# Altium project TSAL_Inverters.PrjPcb
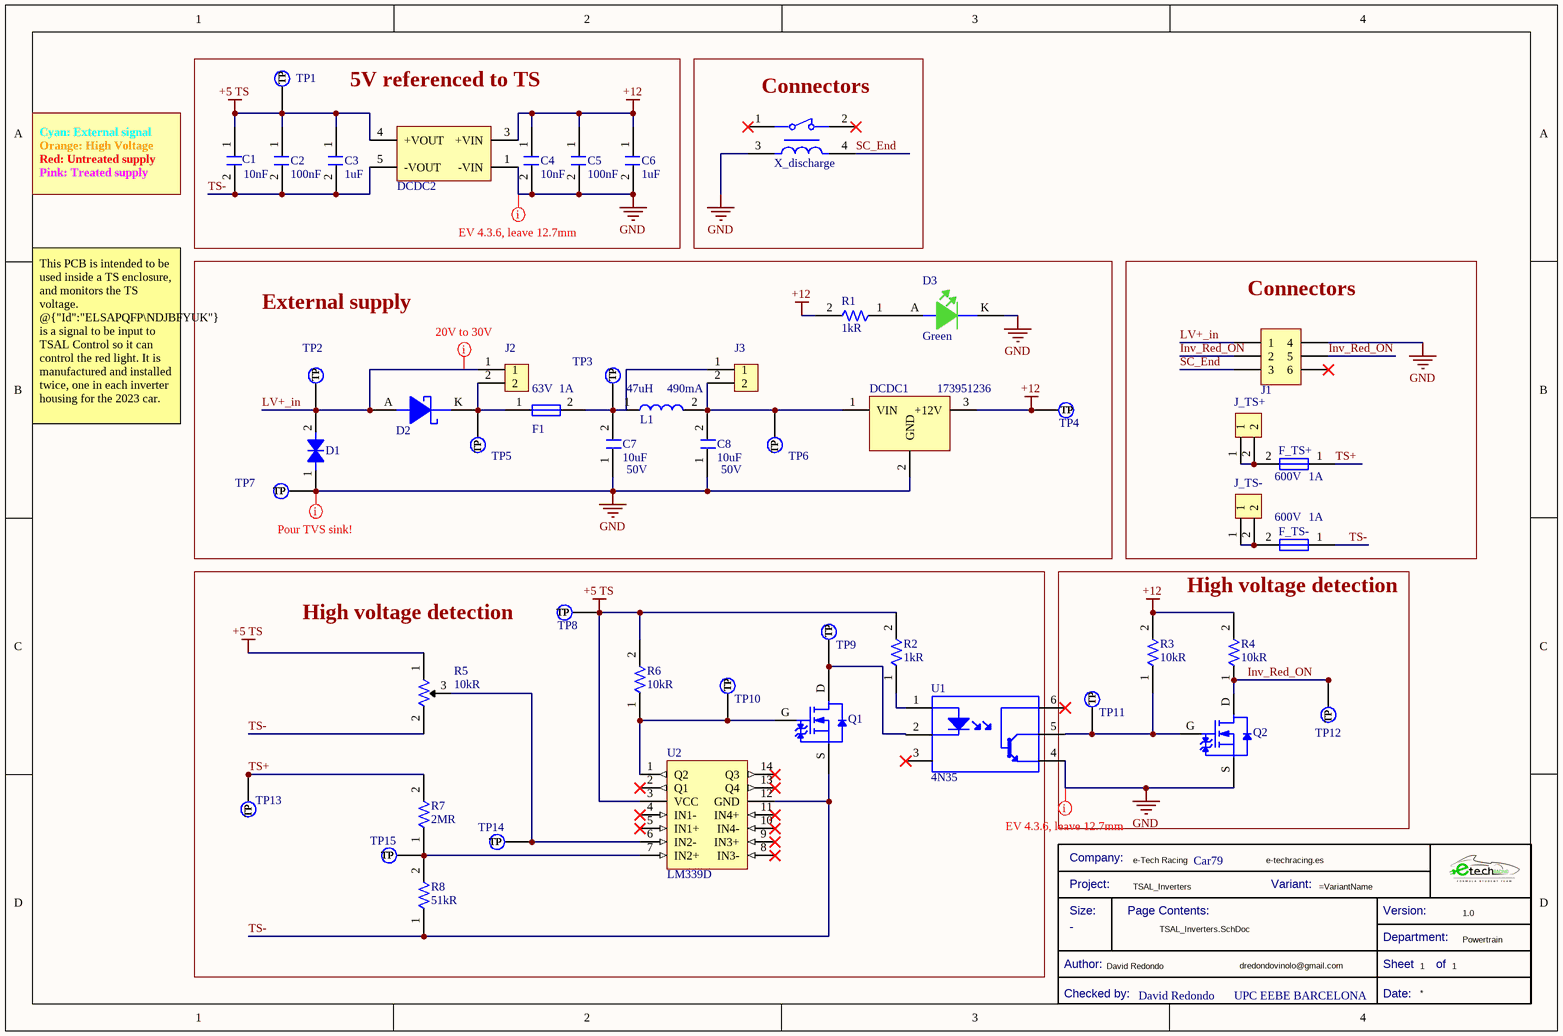
[diagram p0: TSAL_Inverters.SchDoc]
Company: e-Tech Racing; Department: Powertrain; DesignedByURL: e-techracing.es; DesignerMail: dredondovinolo@gmail.com; DesignerName: David Redondo; Project: TSAL_Inverters; ReviewerName: David Redondo; Version: 1.0
1 sheet, 51 parts. Net scope: global (net labels, ports and power ports of the same name join across sheets).
Board file: TSAL_Inverters.PcbDoc

## Sheet TSAL_Inverters.SchDoc
size A4; SheetNumber: 1; SheetTotal: 1

### Parts
*  Checked by:: David Redondo  (hidden comment: Title Block_template)  (graphical)
C1  Capacitance: 10nF  [C0805FNPC-R]  (hidden comment: 885012207092)
C2  Capacitance: 100nF  [C0805FNPC-R]  (hidden comment: 885012207098)
C3  Capacitance: 1uF  [C0805FNPC-R]  (hidden comment: 885012207103)
C4  Capacitance: 10nF  [C0805FNPC-R]  (hidden comment: 885012207092)
C5  Capacitance: 100nF  [C0805FNPC-R]  (hidden comment: 885012207098)
C6  Capacitance: 1uF  [C0805FNPC-R]  (hidden comment: 885012207103)
C7  Voltage Rating: 50V  Capacitance: 10uF  [C10u-50V-1210FNPMLCC-X7R]  (hidden comment: GRJ32ER71H106KE11L)
C8  Voltage Rating: 50V  Capacitance: 10uF  [C10u-50V-1210FNPMLCC-X7R]  (hidden comment: GRJ32ER71H106KE11L)
D1  824551301  [DTVS-DO-214AB]  (value not drawn)
D2  MBR0530  [DSC-SOD123]  (value not drawn)
D3  Color: Green  [LED_0805_WE]  (hidden comment: 150080VS75000)
DCDC1  173951236  [DCDC_Magi3c]
DCDC2  RNM-1205S/P  [DCDC_RNM-XX05S/P]  (value not drawn)
F1  Current Rating: 1A  Voltage Rating (DC): 63V  [Fuse_1206]  (hidden comment: 0437001.WRA)
F_TS+  Voltage Rating (DC): 600V  Current Rating: 1A  [Fuse_485001]  (hidden comment: 485001)
F_TS-  Voltage Rating (DC): 600V  Current Rating: 1A  [Fuse_485001]  (hidden comment: 485001)
J1  J_NanoFit_2x3  [J_NanoFit_2x3]  (value not drawn)
J2  61300211121  [J_Pinheader_1x2]  (value not drawn)
J3  61300211121  [J_Pinheader_1x2]  (value not drawn)
J_TS+  436500215  [J_MicroFit_2x1]  (value not drawn)
J_TS-  436500215  [J_MicroFit_2x1]  (value not drawn)
L1  Current Rating: 490mA  Inductance: 47uH  [L_47u-490mA_CF]  (hidden comment: CDC5D23BNP-470KC)
Q1  SQ2318BES-T1_GE3  [TRT-NCH-3/35-CPH]  (value not drawn)
Q2  SQ2318BES-T1_GE3  [TRT-NCH-3/35-CPH]  (value not drawn)
R1  Resistance: 1kR  [R0805FTK]  (hidden comment: CR0805-JW-102ELF)
R2  Resistance: 1kR  [R0805FTK]  (hidden comment: CR0805-JW-102ELF)
R3  Resistance: 10kR  [R0805FTK]  (hidden comment: CR0805-JW-103ELF)
R4  Resistance: 10kR  [R0805FTK]  (hidden comment: CR0805-JW-103ELF)
R5  Resistance: 10kR  [R10k-VTR]  (hidden comment: 3296W-1-103LF)
R6  Resistance: 10kR  [R0805FTK]  (hidden comment: CR0805-JW-103ELF)
R7  Resistance: 2MR  [R2512FTK]  (hidden comment: R2M-2512FTK)
R8  Resistance: 51kR  [R1206FTK-W]  (hidden comment: CRCW120610K0FKEA)
TP1  TestPoint  [TestPoint]  (value not drawn)  (no BOM)
TP2  TestPoint  [TestPoint]  (value not drawn)  (no BOM)
TP3  TestPoint  [TestPoint]  (value not drawn)  (no BOM)
TP4  TestPoint  [TestPoint]  (value not drawn)  (no BOM)
TP5  TestPoint  [TestPoint]  (value not drawn)  (no BOM)
TP6  TestPoint  [TestPoint]  (value not drawn)  (no BOM)
TP7  TestPoint  [TestPoint]  (value not drawn)  (no BOM)
TP8  TestPoint  [TestPoint]  (value not drawn)  (no BOM)
TP9  TestPoint  [TestPoint]  (value not drawn)  (no BOM)
TP10  TestPoint  [TestPoint]  (value not drawn)  (no BOM)
TP11  TestPoint  [TestPoint]  (value not drawn)  (no BOM)
TP12  TestPoint  [TestPoint]  (value not drawn)  (no BOM)
TP13  TestPoint  [TestPoint]  (value not drawn)  (no BOM)
TP14  TestPoint  [TestPoint]  (value not drawn)  (no BOM)
TP15  TestPoint  [TestPoint]  (value not drawn)  (no BOM)
U1  4N35  [Optocoupler_4N35]
U2  LM339D  [Array_4_Amp_LM339D]
X_discharge  DBR72410FU  [Relay_DAR72410FU]  (value not drawn)

### Blocks framed on the sheet
5V referenced to TS: C1-C6 DCDC2 TP1
Connectors: X_discharge
External supply: C7 C8 D1-D3 DCDC1 F1 J2 J3 L1 R1 TP2-TP7
Connectors: F_TS+ F_TS- J1 J_TS+ J_TS-
High voltage detection: Q1 R2 R5-R8 TP8-TP10 TP13-TP15 U1 U2
High voltage detection: Q2 R3 R4 TP11 TP12

### Nets
+5 TS: C1.1 C2.1 C3.1 DCDC2.4(+VOUT) R2.2 R5.1 R6.2 TP1.1(TP) TP8.1(TP) U2.3(VCC)
+12: C4.1 C5.1 C6.1 DCDC1.3(+12V) DCDC2.3(+VIN) R1.2 R3.2 R4.2 TP4.1(TP)
GND: C4.2 C5.2 C6.2 C7.1 C8.1 D1.1 D3.K DCDC1.2(GND) DCDC2.1(-VIN) J1.4 Q2.S TP7.1(TP) U1.4(E) X_discharge.3
Inv_Red_ON: J1.2 J1.5 Q2.D R4.1 TP12.1(TP)
LV+_in: D1.2 D2.A J1.1 J2.1 TP2.1(TP)
SC_End: J1.3 X_discharge.4
TS+: F_TS+.1 R7.2 TP13.1(TP)
TS-: C1.2 C2.2 C3.2 DCDC2.5(-VOUT) F_TS-.1 Q1.S R5.2 R8.1 U2.12(GND)
NetC7_2: C7.2 F1.2 J3.1 L1.1 TP3.1(TP)
NetC8_2: C8.2 DCDC1.1(VIN) J3.2 L1.2 TP6.1(TP)
NetD2_K: D2.K F1.1 J2.2 TP5.1(TP)
NetD3_A: D3.A R1.1
NetF_TS+_2: F_TS+.2 J_TS+.1 J_TS+.2
NetF_TS-_2: F_TS-.2 J_TS-.1 J_TS-.2
NetQ1_D: Q1.D TP9.1(TP) U1.2(K)
NetQ1_G: Q1.G R6.1 TP10.1(TP) U2.1(Q2)
NetQ2_G: Q2.G R3.1 TP11.1(TP) U1.5(E)
NetR2_1: R2.1 U1.1(A)
NetR5_3: R5.3 TP14.1(TP) U2.6(IN2-)
NetR7_1: R7.1 R8.2 TP15.1(TP) U2.7(IN2+)

Not connected (* = marked no-connect by the designer): J1 6*; U1 3(C)* 6(E)*; U2 2(Q1)* 4(IN1-)* 5(IN1+)* 8(IN3-)* 9(IN3+)* 10(IN4-)* 11(IN4+)* 13(Q4)* 14(Q3)*; X_discharge 1* 2*

### Layout directives
mark named EV 4.3.6, leave 12.7mm: GND
mark named Pour TVS sink!: GND
mark named 20V to 30V: LV+_in

### Notes on the sheet
- Cyan: External signal
- Orange: High Voltage
- Red: Untreated supply
- Pink: Treated supply
- This PCB is intended to be used inside a TS enclosure, and monitors the TS voltage. @{"Id":"ELSAPQFP\NDJBFYUK"} is a signal to be input to TSAL Control so it can control the red light. It is manufactured and installed twice, one in each inverter housing for the 2023 car.
- Car79
- UPC EEBE BARCELONA
- (in symbol Title Block_template) Company:; Project:; Variant:; Size:; Page Contents:; Version:; Department:; Author:; Sheet; of; Checked by:; Date:

### Library data of the parts
* = Title Block_template: Standard Title Block; .Creator: GP; Category: Title Block; .PCBcheck: GP; .SCHcheck: GP; Size: -
C1 C4 = C10n-50V-0805FNPC-X7R: Cap, 0.01ΜF, 50V, 10%, X7R, 0805; Manufacturer 1: Wurth Electronics; .Creator: DR; Supplier 1: RSComponents; Manufacturer Part Number 1: 885012207092; RoHS: Yes; Category: Ceramic Capacitors; Stock 1: 1; Pricing 1: 4000=0,03200, 12000=0,03100 (USD); Mount: Surface Mount; Case/Package: 0805; Case Code (Metric): 2012; Case Code (Imperial): 0805; Min Operating Temperature: -55°C; Max Operating Temperature: 125°C; Packaging: Cut Tape; Voltage Rating: 50V; Dielectric: X7R; Tolerance: 10%; Voltage Rating (DC): 50V; Length: 0.079inch; Width: 0.049inch; Thickness: 0.035inch; REACH SVHC: Unknown; RoHS Compliant: Yes; ComponentLink1URL: http://www.farnell.com/datasheets/1958497.pdf?src-supplier=Farnell; ComponentLink1Description: http://www.farnell.com/datasheets/1958497.pdf?src-supplier=Farnell; ComponentLink2URL: http://www.farnell.com/datasheets/1958497.pdf?src-supplier=Element14; ComponentLink2Description: http://www.farnell.com/datasheets/1958497.pdf?src-supplier=Element14; ComponentLink3URL: http://www.farnell.com/datasheets/1958497.pdf?src-supplier=Newark; ComponentLink3Description: http://www.farnell.com/datasheets/1958497.pdf?src-supplier=Newark; ComponentLink4URL: https://katalog.we-online.de/pbs/datasheet/885012207092.pdf?src-supplier=Digi-Key; ComponentLink4Description: https://katalog.we-online.de/pbs/datasheet/885012207092.pdf?src-supplier=Digi-Key; Supplier Part Number 1: 1813941
C2 C5 = C100n-50V-0805FNPC-X7R: Cap, 0.1ΜF, 50V, 10%, X7R, 0805; Manufacturer 1: Wurth Electronics; .Creator: DR; Supplier 1: RSComponents; Manufacturer Part Number 1: 885012207098; RoHS: Yes; Category: Ceramic Capacitors; Stock 1: 8000; Pricing 1: 100=0,10200, 500=0,07100, 2000=0,06100 (GBP); Mount: Surface Mount; Case/Package: 0805; Case Code (Metric): 2012; Case Code (Imperial): 0805; Min Operating Temperature: -55°C; Max Operating Temperature: 125°C; Packaging: Cut Tape; Voltage Rating: 50V; Dielectric: X7R; Tolerance: 10%; Voltage Rating (DC): 50V; Length: 0.079inch; Width: 0.049inch; Thickness: 0.035inch; REACH SVHC: Unknown; RoHS Compliant: Yes; ComponentLink1URL: http://www.farnell.com/datasheets/1958498.pdf?src-supplier=Farnell; ComponentLink1Description: http://www.farnell.com/datasheets/1958498.pdf?src-supplier=Farnell; ComponentLink2URL: http://www.farnell.com/datasheets/1958498.pdf?src-supplier=Element14; ComponentLink2Description: http://www.farnell.com/datasheets/1958498.pdf?src-supplier=Element14; ComponentLink3URL: https://katalog.we-online.de/pbs/datasheet/885012207098.pdf?src-supplier=Digi-Key; ComponentLink3Description: https://katalog.we-online.de/pbs/datasheet/885012207098.pdf?src-supplier=Digi-Key; ComponentLink4URL: http://www.farnell.com/datasheets/1958498.pdf?src-supplier=Newark; ComponentLink4Description: http://www.farnell.com/datasheets/1958498.pdf?src-supplier=Newark; Supplier Part Number 1: 1813493
C3 C6 = C1u-50V-0805FNPC-X7R: Multilayer Ceramic Capacitor, Wcap-Csgp Series, 1 F, 10%, X7R, 50 V, 0805 [2012 Metric] Rohs Compliant: Yes; Manufacturer 1: Wurth Electronics; Voltage Rating: 50V; .Creator: GP; Supplier 1: RSComponents; Manufacturer Part Number 1: 885012207103; RoHS: Yes; Category: Ceramic Capacitors; Stock 1: 5100; Pricing 1: 50=0,27200, 250=0,25300, 500=0,22800, 1250=0,20100, 2500=0,17100 (GBP); Mount: Surface Mount; Case/Package: 0805; Case Code (Metric): 2012; Case Code (Imperial): 0805; Min Operating Temperature: -55°C; Max Operating Temperature: 85°C; Packaging: Cut Tape; Dielectric: X7R; Tolerance: 10%; Voltage Rating (DC): 50V; Length: 0.079inch; Width: 0.049inch; Thickness: 0.053inch; REACH SVHC: Unknown; RoHS Compliant: Yes; ComponentLink1URL: http://www.farnell.com/datasheets/1958501.pdf?src-supplier=Farnell; ComponentLink1Description: http://www.farnell.com/datasheets/1958501.pdf?src-supplier=Farnell; ComponentLink2URL: http://www.farnell.com/datasheets/1958501.pdf?src-supplier=Element14; ComponentLink2Description: http://www.farnell.com/datasheets/1958501.pdf?src-supplier=Element14; ComponentLink3URL: https://katalog.we-online.de/pbs/datasheet/885012107003.pdf?src-supplier=Digi-Key; ComponentLink3Description: https://katalog.we-online.de/pbs/datasheet/885012107003.pdf?src-supplier=Digi-Key; ComponentLink4URL: http://www.farnell.com/datasheets/1958501.pdf?src-supplier=Newark; ComponentLink4Description: http://www.farnell.com/datasheets/1958501.pdf?src-supplier=Newark; Supplier Part Number 1: 1813523
C7 C8 = C10u-50V-1210FNPMLCC-X7R: Multilayer Ceramic Capacitors MLCC - SMD/SMT 1210 10uF 50volts X7R +/-10% Soft Term; Manufacturer: Murata; Tolerance: 10%; .Creator: DR; Supplier 1: Avnet; Manufacturer Part Number: GRJ32ER71H106KE11L; RoHS: Yes; Category: Ceramic Capacitors; Stock 1: 19000; Pricing 1: 1000=0,33327, 2000=0,32389, 4000=0,31450, 6000=0,30511, 8000=0,29572 (USD); Mount: Surface Mount; Case/Package: 1210; Case Code (Metric): 3225; Case Code (Imperial): 1210; Min Operating Temperature: -55°C; Max Operating Temperature: 125°C; Packaging: Tape and Reel; Features: Soft Termination; Length: 0.126inch; Width: 0.098inch; Thickness: 0.11inch; RoHS Compliant: Yes; ComponentLink1URL: https://eu.mouser.com/datasheet/2/281/GRJ32ER71H106KE11_01-1977929.pdf; ComponentLink1Description: Datasheet; Supplier Part Number 1: GRJ32ER71H106KE11L
D1 = DTVS-40V-DO-214AB: TVS diode [Würth Elektronik] 824551301 TVS diode; Manufacturer: Wurth Electronics; Number of Bidirectional Channels: 1; Reverse Standoff Voltage: 30V; Min Breakdown Voltage: 35.05V; Clamping Voltage: 48.4V; Peak Pulse Power: 3kW; Power Line Protection: No; Polarity: Bidirectional; Peak Pulse Current: 62A; .Creator: DO; ComponentLink2Description: Where buy it; ComponentLink2URL: https://www.we-online.com/catalog/en/WE-TVSP?sq=824551301#824551301; Supplier 1: RSComponents; Manufacturer Part Number: 824551301; RoHS: Yes; Category: TVS Diodes; Stock 1: 1; Pricing 1: 10=1,72500, 50=1,54700, 100=1,45300, 250=1,35100, 500=1,15000 (USD); Mount: Surface Mount; Number of Pins: 2; Min Operating Temperature: -65°C; Max Operating Temperature: 150°C; Packaging: Cut Tape; Max Breakdown Voltage: 35.05V; Resistor Type: Zener; REACH SVHC: Unknown; RoHS Compliant: Yes; ComponentLink1URL: http://www.farnell.com/datasheets/2036459.pdf?src-supplier=Element14; ComponentLink1Description: http://www.farnell.com/datasheets/2036459.pdf?src-supplier=Element14; Supplier Part Number 1: 9217092P
D2 = DSC-0.5/30-SOD123: VR=30V IF=500mA 30pF P=410mW; Element Configuration: Single; Forward Voltage: 430mV; Peak Non-Repetitive Surge Current: 5.5A; Average Rectified Current: 500mA; Max Reverse Leakage Current: 130uA; Max Reverse Voltage (DC): 30V; Polarity: Standard; .Creator: GP; Category: Diode; ComponentLink1Description: Datasheet; ComponentLink1URL: *; ComponentLink2Description: Where buy it; ComponentLink2URL: *; Supplier 1: Newark; Stock 1: 9; Pricing 1: 1=0,34400, 10=0,23900, 100=0,12200, 500=0,10000 (USD); Mount: Surface Mount; Contact Plating: Tin,Matte; Weight: 0.03g; Package Quantity: 1; Max Surge Current: 5.5A; Forward Current: 500mA; Max Reverse Current: 130uA; Max Repetitive Reverse Voltage (Vrrm): 30V; Max Forward Surge Current (Ifsm): 5.5A; Voltage Rating (DC): 30V; Current Rating: 500mA; Output Current: 500mA; Series: -; Length: 2.7mm; Width: 1.6mm; Height: 1.03mm; Radiation Hardening: No; RoHS Compliant: Yes; REACH SVHC: No SVHC; Lead Free: Lead Free; ComponentLink3URL: https://datasheet.ciiva.com/30479/0900766b810e2512-30479401.pdf?src-supplier=RSComponents; ComponentLink3Description: https://datasheet.ciiva.com/30479/0900766b810e2512-30479401.pdf?src-supplier=RSComponents; ComponentLink4URL: https://datasheet.ciiva.com/34301/974753-34301826.pdf?src-supplier=Jameco; ComponentLink4Description: https://datasheet.ciiva.com/34301/974753-34301826.pdf?src-supplier=Jameco; ComponentLink5URL: https://datasheet.ciiva.com/910/mbr0530-910516.pdf?src-supplier=Digi-Key; ComponentLink5Description: https://datasheet.ciiva.com/910/mbr0530-910516.pdf?src-supplier=Digi-Key; ComponentLink6URL: https://datasheet.ciiva.com/25931/mbr0530-25931989.pdf?src-supplier=Avnet+Europe; ComponentLink6Description: https://datasheet.ciiva.com/25931/mbr0530-25931989.pdf?src-supplier=Avnet+Europe; ComponentLink7URL: https://datasheet.ciiva.com/8300/mbr0530-8300905.pdf?src-supplier=Avnet; ComponentLink7Description: https://datasheet.ciiva.com/8300/mbr0530-8300905.pdf?src-supplier=Avnet; ComponentLink8URL: https://datasheet.ciiva.com/17318/mbr0530-17318568.pdf?src-supplier=Future+Electronics; ComponentLink8Description: https://datasheet.ciiva.com/17318/mbr0530-17318568.pdf?src-supplier=Future+Electronics; ComponentLink9URL: https://datasheet.ciiva.com/15144/getdatasheetpartid-86760-15144598.pdf?src-supplier=Verical; ComponentLink9Description: https://datasheet.ciiva.com/15144/getdatasheetpartid-86760-15144598.pdf?src-supplier=Verical; ComponentLink10URL: https://datasheet.ciiva.com/910/mbr0530-910518.pdf?src-supplier=Digi-Key; ComponentLink10Description: https://datasheet.ciiva.com/910/mbr0530-910518.pdf?src-supplier=Digi-Key; Supplier Part Number 1: 15R3453
D3 = LEDVS-0805-40: Led, Green, 570 Nm, 2 V, 30 Ma, 40 Mcd Rohs Compliant: Yes; Manufacturer 1: Wurth Electronics; Luminous Intensity: 40mcd; Forward Current: 30mA; Forward Voltage: 2V; Viewing Angle: 140°; Wavelength: 570nm; Lens Style: Clear,Rectangular; Test Current: 20mA; .Creator: DR; ComponentLink1Description: Datasheet; ComponentLink1URL: https://www.we-online.com/catalog/datasheet/150080VS75000.pdf; ComponentLink2Description: Where buy it; ComponentLink2URL: https://katalog.we-online.de/en/led/WL-SMCW/150080VS75000; Supplier 1: RSComponents; Manufacturer Part Number 1: 150080VS75000; RoHS: Yes; Category: LEDs; Stock 1: 850; Pricing 1: 50=0,19300, 500=0,12900, 1000=0,12300, 2000=0,11700, 4000=0,11100 (USD); Mount: Surface Mount; Case/Package: 0805; Case Code (Metric): 2012; Case Code (Imperial): 0805; Min Operating Temperature: -40°C; Max Operating Temperature: 85°C; Package Quantity: 4000; Packaging: Tape and Reel; Dominant Wavelength: 570nm; Length: 2mm; Width: 1.25mm; Height: 0.7mm; REACH SVHC: Unknown; ComponentLink3URL: https://datasheet.ciiva.com/22656/150080vs75000-22656966.pdf?src-supplier=Element14; ComponentLink3Description: https://datasheet.ciiva.com/22656/150080vs75000-22656966.pdf?src-supplier=Element14; ComponentLink4URL: https://datasheet.ciiva.com/29279/759437-da-01-en-chipled-0805-w-kl-h-gruen-150080vs7500-29279047.pdf?src-supplier=Conrad; ComponentLink4Description: https://datasheet.ciiva.com/29279/759437-da-01-en-chipled-0805-w-kl-h-gruen-150080vs7500-29279047.pdf?src-supplier=Conrad; ComponentLink5URL: https://datasheet.ciiva.com/29563/150080vs75000-29563018.pdf?src-supplier=Digi-Key; ComponentLink5Description: https://datasheet.ciiva.com/29563/150080vs75000-29563018.pdf?src-supplier=Digi-Key; Supplier Part Number 1: 8154237
DCDC1 = DCDC-36V/12V-0.5A: Fdsm Fixed Step Down Regulator M; Manufacturer 1: Wurth Electronics; Supplier 1: Digi-Key; Manufacturer Part Number 1: 173951236; RoHS: No; Category: Board Mount Modules; Stock 1: 32; Pricing 1: 1=3,29000, 10=2,99100, 20=2,81300, 30=2,63600, 43=2,39907 (USD); Supplier Part Number 1: 732-173951236-ND; ComponentLink1Description: Datasheet; ComponentLink1URL: https://www.we-online.com/catalog/datasheet/173951236.pdf
DCDC2 = DCDC_RNM-1205S/P: 1W DC/DC-Converter 'ECONOLINE' DIP6 1kV unreg; V. In: 12; V. Out: 05; mA. Out: 200; Manufacturer 1: Recom; Min Input Voltage: 10.8V; Number of Outputs: 1; Efficiency: 78%; Voltage - Output 1: 5V; Max Input Voltage: 13.2V; Max Output Current: 200mA; Nominal Input Voltage: 12V; Supplier 1: Mouser; Manufacturer Part Number 1: RNM-1205S/P; RoHS: Yes; Category: Voltage Regulators - Switching; Stock 1: 40; Pricing 1: 1=8,32000, 10=8,08000, 50=7,84000, 100=7,60000, 1000=6,65000, 10000=6,42000 (USD); Mount: Through Hole; Case/Package: DIP; Weight: 1.1g; Min Operating Temperature: -40°C; Max Operating Temperature: 85°C; Output Power: 1W; Packaging: Rail/Tube; Package Quantity: 60; Isolation Voltage: 1kV; Max Power Dissipation: 1W; Max Output Voltage: 5V; Features: SCP; Series: ECONOLINE RNM; Length: 8.3mm; Width: 8.3mm; Height: 6.8mm; Lead Free: Lead Free; RoHS Compliant: Yes; ComponentLink1URL: https://datasheet.ciiva.com/2172/rnm-2172495.pdf?src-supplier=Digi-Key; ComponentLink1Description: https://datasheet.ciiva.com/2172/rnm-2172495.pdf?src-supplier=Digi-Key; Supplier Part Number 1: 919-RNM-1205S/P
F1 = Fuse_1A_63V_1206: Fuse Chip Fast Acting 1A 63V SMD Solder Pad 1206 Ceramic T/R Automotive; Manufacturer: Littelfuse; Fuse Type: Board Mount (Cartridge Style Excluded); Approvals: CSA,cURus; .Creator: DO; Supplier 1: Digi-Key; Manufacturer Part Number: 0437001.WRA; RoHS: Yes; Category: Fuses; Stock 1: 5820; Pricing 1: 1=1,52000, 5=1,47000, 10=1,37600, 50=1,13860, 100=0,94880, 250=0,92508, 500=0,78276, 1000=0,68788 (USD); Mount: Surface Mount; Case/Package: 1206; Case Code (Imperial): 1206; Case Code (Metric): 3216; Min Operating Temperature: -55°C; Max Operating Temperature: 150°C; Packaging: Tape and Reel; Voltage Rating (AC): 63V; ComponentLink1URL: https://www.littelfuse.com/~/media/electronics/datasheets/fuses/littelfuse_fuse_437a_datasheet.pdf.pdf?src-supplier=Digi-Key; ComponentLink1Description: https://www.littelfuse.com/~/media/electronics/datasheets/fuses/littelfuse_fuse_437a_datasheet.pdf.pdf?src-supplier=Digi-Key; Supplier Part Number 1: F10001CT-ND; ComponentLink2Description: Where buy it; ComponentLink2URL: https://www.mouser.es/ProductDetail/Littelfuse/0437001WRA?qs=DXv0QSHKF4z9CJhPXjxR%252BA%3D%3D
F_TS+ F_TS- = Fuse_1A_600V: Surface Mount Fuses 600V 1A Fast Acting; Manufacturer 1: Littelfuse; Manufacturer Part Number 1: 0485001.DR; Body Material: Ceramic; Voltage Rating (AC): 250V; Resistance: 264mR; DC Cold Resistance: 304.4mR; Fuse Type: Board Mount (Cartridge Style Excluded); Approvals: UL,CSA; .Creator: DO; Supplier 1: Arrow Electronics; RoHS: Yes; Category: Fuses; Stock 1: 4123; Pricing 1: 1=2,82900, 5=2,81400, 10=2,75200, 50=2,59800, 100=2,40300, 250=2,37900, 500=2,30400, 1500=2,24900, 3000=2,11600 (USD); Mount: Surface Mount; Case/Package: SMD/SMT; Housing Material: Ceramic; Min Operating Temperature: -55°C; Max Operating Temperature: 125°C; Packaging: Tape and Reel; Package Quantity: 1; Series: 485; Termination: SMD/SMT; Fuse Current: 1A; Length: 12.1mm; Width: 0.177inch; Height: 0.177inch; Depth: 4.5mm; REACH SVHC: No SVHC; Lead Free: Lead Free; RoHS Compliant: Yes; ComponentLink1URL: http://www.farnell.com/datasheets/1945989.pdf?src-supplier=Farnell; ComponentLink1Description: http://www.farnell.com/datasheets/1945989.pdf?src-supplier=Farnell; ComponentLink2URL: http://www.farnell.com/datasheets/2282568.pdf?src-supplier=Farnell; ComponentLink2Description: http://www.farnell.com/datasheets/2282568.pdf?src-supplier=Farnell; ComponentLink3URL: http://www.mouser.com/ds/2/240/Littelfuse485_datasheet_080512-201879.pdf?src-supplier=Mouser; ComponentLink3Description: http://www.mouser.com/ds/2/240/Littelfuse485_datasheet_080512-201879.pdf?src-supplier=Mouser; ComponentLink4URL: http://components.arrow.com/part/dataview/56707787S790276N3675?src-supplier=Arrow+Electronics; ComponentLink4Description: http://components.arrow.com/part/dataview/56707787S790276N3675?src-supplier=Arrow+Electronics; ComponentLink5URL: http://www.littelfuse.com/~/media/Files/Littelfuse/Technical%20Resources/Documents/Data%20Sheets/Littelfuse_Fuse_485_Datasheet.pdf?src-supplier=Element14; ComponentLink5Description: http://www.littelfuse.com/~/media/Files/Littelfuse/Technical%20Resources/Documents/Data%20Sheets/Littelfuse_Fuse_485_Datasheet.pdf?src-supplier=Element14; ComponentLink6URL: http://www.littelfuse.com/~/media/electronics/datasheets/fuses/littelfuse_fuse_485_datasheet.pdf.pdf?src-supplier=Digi-Key; ComponentLink6Description: http://www.littelfuse.com/~/media/electronics/datasheets/fuses/littelfuse_fuse_485_datasheet.pdf.pdf?src-supplier=Digi-Key; Supplier Part Number 1: 0485001.DR; Voltage Rating: 600V
J2 J3 = J_Jumper: CONN HEADER 2 POS 2.54; Manufacturer: Molex; Temperature rating: -40° to +105°C; Category type: PCB-PCB; Product name: Pin Header; Maximum current: 3 A; Maximum voltage: 250 V AC; Connections: 1x2; Current Rating: 3A; Voltage Rating: 250V; Number of Positions: 2; Gender: Male; Connector Type: Male Pin; Pitch: 0.1inch; .Creator: GP; Category: Connector; ComponentLink1Description: Datasheet; ComponentLink1URL: https://www.we-online.com/catalog/datasheet/61300211121.pdf; ComponentLink2Description: Where buy it; ComponentLink2URL: https://www.we-online.com/catalog/en/PHD_2_54_THT_PIN_HEADER_6130XX11121?sq=61300211121&sp=https%3A%2F%2Fwww.we-online.com%2Fweb%2Fen%2Fwuerth_elektronik%2Fsearchpage.php%3Fsearch%3D61300211121#61300211121; Manufacturer part number: 61300211121; Supplier: Würth Elektronik; RoHS: *; Application: Shortcircuit; Flammability: 94V-0; Orientation: Vertical; Mount: Through hole; Supplier 1: RSComponents; Stock 1: 1855; Pricing 1: 5=0,14100, 50=0,09700, 100=0,07800, 200=0,07300, 500=0,06800 (USD); Contact Plating: Gold; Housing Material: PBT; Contact Material: Copper Alloy,Copper; Color: Black; Min Operating Temperature: -40°C; Max Operating Temperature: 125°C; Number of Rows: 1; Contact Gender: Male; Packaging: Bulk; Termination: Through Hole; Number of Contacts: 2; Contact Mating Length: 0.236inch; REACH SVHC: Unknown; Lead Free: Lead Free; ComponentLink3URL: https://datasheet.ciiva.com/13619/6130xx11121-48870-13619345.pdf?src-supplier=Mouser; ComponentLink3Description: https://datasheet.ciiva.com/13619/6130xx11121-48870-13619345.pdf?src-supplier=Mouser; Supplier Part Number 1: 8281581
J_TS+ J_TS- = J_MicroFit_2x1: Header 1 Row Vertical Polarizing Peg 2 Pin SMT/Glow Wire Compatible Tin Plate; Manufacturer 1: Molex; Manufacturer Part Number 1: 43650-0215; Supplier 1: Arrow Electronics; RoHS: Yes; Category: Headers and Wire Housings; Stock 1: 11086; Pricing 1: 1=0,87800, 10=0,74400, 80=0,63070, 3264=0,47000, 6528=0,45100, 13056=0,41760 (USD); ComponentLink1URL: https://datasheet.ciiva.com/19462/884109-19462034.pdf?src-supplier=Jameco; ComponentLink1Description: https://datasheet.ciiva.com/19462/884109-19462034.pdf?src-supplier=Jameco; ComponentLink2URL: https://datasheet.ciiva.com/5157/0436500215-pcb-headers-148687-5157608.pdf?src-supplier=Mouser; ComponentLink2Description: https://datasheet.ciiva.com/5157/0436500215-pcb-headers-148687-5157608.pdf?src-supplier=Mouser; ComponentLink3URL: https://datasheet.ciiva.com/16085/0436500215-pcb-headers-16085668.pdf?src-supplier=Onlinecomponents.com; ComponentLink3Description: https://datasheet.ciiva.com/16085/0436500215-pcb-headers-16085668.pdf?src-supplier=Onlinecomponents.com; ComponentLink4URL: https://datasheet.ciiva.com/11748/0900766b80307ce2-11748388.pdf?src-supplier=RSComponents; ComponentLink4Description: https://datasheet.ciiva.com/11748/0900766b80307ce2-11748388.pdf?src-supplier=RSComponents; ComponentLink5URL: https://datasheet.ciiva.com/9432/0436500215-pcb-headers-9432850.pdf?src-supplier=Avnet; ComponentLink5Description: https://datasheet.ciiva.com/9432/0436500215-pcb-headers-9432850.pdf?src-supplier=Avnet; ComponentLink6URL: https://datasheet.ciiva.com/7920/1889390-7920892.pdf?src-supplier=Element14; ComponentLink6Description: https://datasheet.ciiva.com/7920/1889390-7920892.pdf?src-supplier=Element14; Supplier Part Number 1: 43650-0215
L1 = L_47u-490mA_CF: Inductor Power Unshielded Wirewound 47uH 10% 100KHz Ferrite 490mA 546mOhm DCR T/R; Manufacturer: Sumida; DC Resistance (DCR): 546mR; .Creator: GP; Supplier 1: Mouser; Manufacturer Part Number: CDC5D23BNP-470KC; RoHS: Yes; Category: Fixed Inductors; Stock 1: 3779; Pricing 1: 1=0,95000, 10=0,71100, 50=0,71100, 100=0,59700, 1000=0,40600, 10000=0,38100 (USD); Mount: Surface Mount; Case/Package: Nonstandard; Core Material: Ferrite; Weight: 0.007584oz; Min Operating Temperature: -40°C; Max Operating Temperature: 100°C; Tolerance: 10%; Shielding: Unshielded; Packaging: Tape and Reel; Package Quantity: 2000; Max DC Current: 490mA; Termination: SMD/SMT; Test Frequency: 100kHz; Series: CDC5D23B; Length: 0.228inch; Width: 5.8mm; Height: 2.5mm; Height - Seated (Max): 0.098inch; Lead Free: Lead Free; RoHS Compliant: Yes; ComponentLink1URL: http://www.mouser.com/ds/2/390/CDC5D23B-465898.pdf?src-supplier=Mouser; ComponentLink1Description: http://www.mouser.com/ds/2/390/CDC5D23B-465898.pdf?src-supplier=Mouser; ComponentLink3URL: http://products.sumida.com/products/pdf/CDC5D23B.pdf?src-supplier=Digi-Key; ComponentLink3Description: http://products.sumida.com/products/pdf/CDC5D23B.pdf?src-supplier=Digi-Key; Supplier Part Number 1: 851-CDC5D23BNP-470KC
Q1 Q2 = TRT-NCH-8/40-SQ: Automotive N-channel 40 V (d-s) 175C Mosfet SOT-23; Manufacturer 1: Vishay; Id: 8A; Vds: 40V; .Creator: DO; Supplier 1: Newark; Manufacturer Part Number 1: SQ2318BES-T1_GE3; RoHS: No; Pricing 1: 1=0,71500, 5=0,71500, 10=0,64400, 25=0,59000, 50=0,52500, 100=0,47100, 250=0,40800 (USD); Supplier Part Number 1: 81AH9290; ComponentLink1Description: Where to buy; ComponentLink1URL: https://www.mouser.es/ProductDetail/Vishay-Siliconix/SQ2318BES-T1_GE3?qs=sPbYRqrBIVmyZcxPsDt0vA%3D%3D; ComponentLink2Description: Datasheet; ComponentLink2URL: https://www.mouser.es/datasheet/2/427/sq2318bes-1868475.pdf
R1 R2 = R1k-0805FTK: Res Thick Film 0805 1K Ohm 5% 1/8W ±200ppm/°C Molded SMD SMD Paper Tape on Plastic Reel; Manufacturer 1: Bourns; Voltage Rating (DC): 150V; Power Rating: 125mW; .Creator: GP; Supplier 1: Arrow Electronics; Manufacturer Part Number 1: CR0805-JW-102ELF; RoHS: Yes; Category: Chip SMD Resistors; Stock 1: 27510; Pricing 1: 1=0,05930, 10=0,03510, 25=0,01790, 100=0,00800, 250=0,00790, 500=0,00590, 1000=0,00360, 3000=0,00350, 6000=0,00250 (USD); Mount: Surface Mount; Case/Package: 0805; Number of Pins: 2; Contact Plating: Tin; Case Code (Metric): 2012; Case Code (Imperial): 0805; Min Operating Temperature: -55°C; Max Operating Temperature: 155°C; Resistor Type: Thick Film; Tolerance: 5%; Temperature Coefficient: 200ppm/°C; Features: Moisture Resistant; Package Quantity: 1; Packaging: Tape and Reel; Voltage Rating: 150V; Number of Terminations: 2; Termination: SMD/SMT; Max Power Dissipation: 125mW; Length: 2mm; Width: 1.25mm; Height: 0.5mm; Thickness: 508um; Depth: 1.25mm; Radiation Hardening: No; Lead Free: Lead Free; REACH SVHC: No SVHC; Military Standard: Not; ComponentLink1URL: https://datasheet.ciiva.com/11821/0900766b80fcdb72-11821134.pdf?src-supplier=RSComponents; ComponentLink1Description: https://datasheet.ciiva.com/11821/0900766b80fcdb72-11821134.pdf?src-supplier=RSComponents; ComponentLink2URL: https://datasheet.ciiva.com/15225/getdatasheetpartid-78155-15225381.pdf?src-supplier=Verical; ComponentLink2Description: https://datasheet.ciiva.com/15225/getdatasheetpartid-78155-15225381.pdf?src-supplier=Verical; ComponentLink3URL: https://datasheet.ciiva.com/22693/1902866-22693253.pdf?src-supplier=Element14; ComponentLink3Description: https://datasheet.ciiva.com/22693/1902866-22693253.pdf?src-supplier=Element14; ComponentLink4URL: https://datasheet.ciiva.com/7986/1856384-7986184.pdf?src-supplier=Element14; ComponentLink4Description: https://datasheet.ciiva.com/7986/1856384-7986184.pdf?src-supplier=Element14; ComponentLink5URL: https://datasheet.ciiva.com/7985/1856384-7985867.pdf?src-supplier=Element14; ComponentLink5Description: https://datasheet.ciiva.com/7985/1856384-7985867.pdf?src-supplier=Element14; ComponentLink6URL: https://datasheet.ciiva.com/30242/159chpreztr-30242765.pdf?src-supplier=Onlinecomponents.com; ComponentLink6Description: https://datasheet.ciiva.com/30242/159chpreztr-30242765.pdf?src-supplier=Onlinecomponents.com; ComponentLink7URL: https://datasheet.ciiva.com/6547/chpreztr-6547359.pdf?src-supplier=Digi-Key; ComponentLink7Description: https://datasheet.ciiva.com/6547/chpreztr-6547359.pdf?src-supplier=Digi-Key; Supplier Part Number 1: CR0805-JW-102ELF
R3 R4 R6 = R10k-0805FTK: BOURNS         CR0805-JW-103ELF            Surface Mount Chip Resistor, Thick Film, CR Series, 10 kohm, 125 mW,  5%, 150 V; Temperature Coefficient: 200ppm/°C; Power Rating: 125mW; Voltage Rating: 150V; Voltage Rating (DC): 100V; .Creator: DR; Supplier 1: Arrow Electronics; Manufacturer 1: Bourns; Manufacturer Part Number 1: CR0805-JW-103ELF; RoHS: Yes; Category: Chip SMD Resistors; Stock 1: 57566; Pricing 1: 1=0,05790, 10=0,01540, 25=0,01340, 100=0,00340 (USD); Mount: Surface Mount; Case/Package: 0805; Number of Pins: 2; Contact Plating: Tin; Case Code (Metric): 2012; Case Code (Imperial): 0805; Min Operating Temperature: -55°C; Max Operating Temperature: 155°C; Tolerance: 5%; Resistor Type: Thick Film; Package Quantity: 1; Packaging: Tape and Reel; Number of Terminations: 2; Termination: SMD/SMT; Max Power Dissipation: 125mW; Features: Moisture Resistant; Series: CR0805; Construction: Rectangular; Resistance Tolerance: 5%; Technology: THICK FILM; Length: 2mm; Width: 1.25mm; Height: 0.5mm; Depth: 1.25mm; Thickness: 508um; Radiation Hardening: No; REACH SVHC: No SVHC; Military Standard: Not; RoHS Compliant: Yes; ComponentLink1URL: https://datasheet.ciiva.com/11821/0900766b80fcdb72-11821135.pdf?src-supplier=RSComponents; ComponentLink1Description: https://datasheet.ciiva.com/11821/0900766b80fcdb72-11821135.pdf?src-supplier=RSComponents; ComponentLink2URL: https://datasheet.ciiva.com/9122/chpreztr-9122374.pdf?src-supplier=Avnet; ComponentLink2Description: https://datasheet.ciiva.com/9122/chpreztr-9122374.pdf?src-supplier=Avnet; ComponentLink3URL: https://datasheet.ciiva.com/22693/1902866-22693254.pdf?src-supplier=Element14; ComponentLink3Description: https://datasheet.ciiva.com/22693/1902866-22693254.pdf?src-supplier=Element14; ComponentLink4URL: https://datasheet.ciiva.com/7986/691949-7986187.pdf?src-supplier=Element14; ComponentLink4Description: https://datasheet.ciiva.com/7986/691949-7986187.pdf?src-supplier=Element14; ComponentLink5URL: https://datasheet.ciiva.com/30065/159chpreztr-30065976.pdf?src-supplier=Onlinecomponents.com; ComponentLink5Description: https://datasheet.ciiva.com/30065/159chpreztr-30065976.pdf?src-supplier=Onlinecomponents.com; ComponentLink6URL: https://datasheet.ciiva.com/16783/70154685-16783482.pdf?src-supplier=Allied+Electronics; ComponentLink6Description: https://datasheet.ciiva.com/16783/70154685-16783482.pdf?src-supplier=Allied+Electronics; ComponentLink7URL: https://datasheet.ciiva.com/5548/chpreztr-5548491.pdf?src-supplier=Mouser; ComponentLink7Description: https://datasheet.ciiva.com/5548/chpreztr-5548491.pdf?src-supplier=Mouser; ComponentLink8URL: https://datasheet.ciiva.com/6559/chpreztr-6559900.pdf?src-supplier=Digi-Key; ComponentLink8Description: https://datasheet.ciiva.com/6559/chpreztr-6559900.pdf?src-supplier=Digi-Key; ComponentLink9URL: https://datasheet.ciiva.com/6559/chpreztr-6559901.pdf?src-supplier=Digi-Key; ComponentLink9Description: https://datasheet.ciiva.com/6559/chpreztr-6559901.pdf?src-supplier=Digi-Key; ComponentLink10URL: https://datasheet.ciiva.com/7985/1856384-7985869.pdf?src-supplier=Element14; ComponentLink10Description: https://datasheet.ciiva.com/7985/1856384-7985869.pdf?src-supplier=Element14; ComponentLink11URL: https://datasheet.ciiva.com/48692/001055517-da-01-en-smd-wid-cr0805-jw-103elf-10k-ohm-1-8w-48692118.pdf?src-supplier=Conrad; ComponentLink11Description: https://datasheet.ciiva.com/48692/001055517-da-01-en-smd-wid-cr0805-jw-103elf-10k-ohm-1-8w-48692118.pdf?src-supplier=Conrad; Supplier Part Number 1: CR0805-JW-103ELF
R5 = R10k-VTR: Trimmer, Cermet, Rest 10 Kilohms, PCB, 25 Turns, Pwr-Rtg 0.5W, 3296 Series; Manufacturer: Bourns; Tolerance: 10%; Power Rating: 500mW; Number of Turns: 25; Temperature Coefficient: 100ppm/°C; Insulation Resistance: 1GR; .Creator: DO; Supplier 1: RSComponents; Manufacturer Part Number: 3296W-1-103LF; RoHS: Yes; Category: Variable Resistors and Potentiometers; Stock 1: 3300; Pricing 1: 50=2,54800, 100=2,31900, 200=2,14000, 300=1,88400, 500=1,55300 (USD); Mount: PCB,Through Hole; Weight: 0.03oz; Color: Blue; Contact Plating: Tin,Matte; Min Operating Temperature: -55°C; Max Operating Temperature: 125°C; Packaging: Rail/Tube; Package Quantity: 50; Termination: Pin; Resistor Type: Cermet; Technology: CERMET; Taper: Linear; Max Power Dissipation: 500mW; Series: 3296; Resistance Tolerance: 10%; Length: 9.53mm; Width: 9.53mm; Height: 0.395inch; Depth: 4.83mm; Radiation Hardening: No; REACH SVHC: No SVHC; Military Standard: Not; Lead Free: Lead Free; RoHS Compliant: Yes; ComponentLink1URL: https://datasheet.ciiva.com/19454/853572-19454866.pdf?src-supplier=Jameco; ComponentLink1Description: https://datasheet.ciiva.com/19454/853572-19454866.pdf?src-supplier=Jameco; ComponentLink2URL: https://datasheet.ciiva.com/11830/0900766b8069ccf4-11830871.pdf?src-supplier=RSComponents; ComponentLink2Description: https://datasheet.ciiva.com/11830/0900766b8069ccf4-11830871.pdf?src-supplier=RSComponents; ComponentLink3URL: https://datasheet.ciiva.com/29122/447277-da-01-en-trimmer-tht3296w-1-103lf-10k-0-5w-29122362.pdf?src-supplier=Conrad; ComponentLink3Description: https://datasheet.ciiva.com/29122/447277-da-01-en-trimmer-tht3296w-1-103lf-10k-0-5w-29122362.pdf?src-supplier=Conrad; ComponentLink4URL: https://datasheet.ciiva.com/26913/3296w-1-103lf-26913885.pdf?src-supplier=IIIC; ComponentLink4Description: https://datasheet.ciiva.com/26913/3296w-1-103lf-26913885.pdf?src-supplier=IIIC; ComponentLink5URL: https://datasheet.ciiva.com/1131/1815117-1131273.pdf?src-supplier=Element14; ComponentLink5Description: https://datasheet.ciiva.com/1131/1815117-1131273.pdf?src-supplier=Element14; ComponentLink6URL: https://datasheet.ciiva.com/18411/70153578-18411561.pdf?src-supplier=Allied+Electronics; ComponentLink6Description: https://datasheet.ciiva.com/18411/70153578-18411561.pdf?src-supplier=Allied+Electronics; ComponentLink7URL: https://datasheet.ciiva.com/3266/3296-3266187.pdf?src-supplier=Avnet; ComponentLink7Description: https://datasheet.ciiva.com/3266/3296-3266187.pdf?src-supplier=Avnet; ComponentLink8URL: https://datasheet.ciiva.com/30093/3296-30093899.pdf?src-supplier=Onlinecomponents.com; ComponentLink8Description: https://datasheet.ciiva.com/30093/3296-30093899.pdf?src-supplier=Onlinecomponents.com; ComponentLink9URL: https://datasheet.ciiva.com/2156/3296-2156893.pdf?src-supplier=Digi-Key; ComponentLink9Description: https://datasheet.ciiva.com/2156/3296-2156893.pdf?src-supplier=Digi-Key; ComponentLink10URL: https://datasheet.ciiva.com/14173/ew3296-dat-e-14173022.pdf?src-supplier=Distrelec; ComponentLink10Description: https://datasheet.ciiva.com/14173/ew3296-dat-e-14173022.pdf?src-supplier=Distrelec; Supplier Part Number 1: 1673377; ComponentLink11Description: Where buy it; ComponentLink11URL: https://es.rs-online.com/web/p/potenciometros-de-ajuste/5219647
R7 = R2M-2512FTK: Current Sense Resistors - SMD 3watts .002ohms 1%; Manufacturer: Vishay Dale; Manufacturer Part Number: WSLP25122L000FEA; Temperature Coefficient: 275ppm/°C; Power Rating: 3W; Supplier 1: Mouser; RoHS: Yes; Category: Chip SMD Resistors; Stock 1: 11994; Pricing 1: 1=1,07000, 10=1,07000, 50=1,07000, 100=1,07000, 1000=0,77100, 10000=0,75500 (USD); Mount: Surface Mount; Case/Package: 2512; Case Code (Imperial): 2512; Case Code (Metric): 6432; Weight: 0.001429oz; Size Code: 2512; Min Operating Temperature: -65°C; Max Operating Temperature: 170°C; Tolerance: 1%; Packaging: Tape and Reel; Resistor Type: Metal Strip; Package Quantity: 2000; Termination: SMD/SMT; Series: WSLP; Length: 6.4mm; Width: 3.2mm; Height: 0.635mm; RoHS Compliant: Yes; Lead Free: Lead Free; ComponentLink1URL: https://datasheet.ciiva.com/48527/wslp-48527354.pdf?src-supplier=Avnet; ComponentLink1Description: https://datasheet.ciiva.com/48527/wslp-48527354.pdf?src-supplier=Avnet; Supplier Part Number 1: 71-WSLP25122L000FEA
R8 = R51k-1206FTK: Res Thick Film 1206 51K Ohm 1% 1/4W ±100ppm/°C Molded SMD SMD Punched Carrier T/R; Manufacturer: Panasonic; Manufacturer Part Number: ERJ-S08F5102V; Power Rating: 250mW; Voltage Rating: 150V; Voltage Rating (DC): 200V; Current Rating: 2A; .Creator: DO; Category: Resistor; ComponentLink1Description: Datasheet; ComponentLink1URL: https://docs.rs-online.com/bca8/A700000006404581.pdf; ComponentLink2Description: Where buy it; ComponentLink2URL: https://es.rs-online.com/web/p/resistencias-de-montaje-en-superficie/6791765; Supplier 1: Mouser; RoHS: Yes; Stock 1: 4091; Pricing 1: 1=0,31000, 10=0,26700, 50=0,26700, 100=0,10700, 1000=0,05100, 10000=0,03400 (USD); Mount: Surface Mount; Case/Package: 1206; Case Code (Metric): 3216; Case Code (Imperial): 1206; Contact Plating: Tin; Min Operating Temperature: -55°C; Max Operating Temperature: 155°C; Packaging: Tape and Reel; Tolerance: 1%; Package Quantity: 5000; Resistor Type: Thick Film; Number of Terminations: 2; Temperature Coefficient: 100ppm/°C; Max Power Dissipation: 250mW; Features: Anti-Sulfur; Series: ERJ; Construction: Rectangular; Length: 3.2mm; Width: 0.063inch; Height: 0.028inch; Depth: 1.6mm; Military Standard: Not; Lead Free: Lead Free; RoHS Compliant: Yes; ComponentLink3URL: https://datasheet.ciiva.com/24023/aoa0000ce5-24023518.pdf?src-supplier=Mouser; ComponentLink3Description: https://datasheet.ciiva.com/24023/aoa0000ce5-24023518.pdf?src-supplier=Mouser; ComponentLink4URL: https://datasheet.ciiva.com/9189/aoa0000ce5-9189211.pdf?src-supplier=Avnet; ComponentLink4Description: https://datasheet.ciiva.com/9189/aoa0000ce5-9189211.pdf?src-supplier=Avnet; Supplier Part Number 1: 667-ERJ-S08F5102V
TP1-TP15 = TestPoint: Test Point 1x1 mm; .Creator: GP; Category: TestPoint; .PCBcheck: GP; .SCHcheck: GP
U1 = Optocoupler_4N35: Optocoupler DC-IN 1-CH Transistor With Base DC-OUT 6-Pin PDIP SMD T/R; Manufacturer: Vishay Lite-On; Manufacturer Part Number: CNY17-4S-TA1; Number of Channels: 1; Max Power Dissipation: 250mW; Isolation Voltage: 5kV; Output Voltage: 70V; Forward Voltage: 1.65V; Rise Time: 10000ns; Collector Emitter Saturation Voltage: 300mV; Max Input Current: 60mA; Reverse Breakdown Voltage: 6V; Input Type: DC; Current Transfer Ratio: 320%; Output Current per Channel: 150mA; .Creator: DO; Supplier 1: RSComponents; RoHS: Yes; Category: Optocouplers; Stock 1: 1; Pricing 1: 50=0,27200, 250=0,25600, 500=0,24000, 1250=0,22500, 2500=0,21200 (USD); Mount: Surface Mount; Case/Package: SMD/SMT; Number of Pins: 6; Min Operating Temperature: -55°C; Max Operating Temperature: 100°C; Packaging: Tape and Reel; Package Quantity: 1000; Power Dissipation: 250mW; Collector Emitter Voltage (VCEO): 70V; Max Output Voltage: 70V; Number of Elements: 1; Series: -; Forward Current: 60mA; Collector-emitter Voltage-Max: 300mV; Fall Time: 10000ns; Number of Circuits: 1; Max Collector Current: 150mA; Radiation Hardening: No; Lead Free: Lead Free; RoHS Compliant: Yes; ComponentLink1URL: https://datasheet.ciiva.com/15118/getdatasheetpartid-187668-15118874.pdf?src-supplier=Verical; ComponentLink1Description: https://datasheet.ciiva.com/15118/getdatasheetpartid-187668-15118874.pdf?src-supplier=Verical; ComponentLink2URL: https://datasheet.ciiva.com/6573/s-110-cny17-6573733.pdf?src-supplier=Digi-Key; ComponentLink2Description: https://datasheet.ciiva.com/6573/s-110-cny17-6573733.pdf?src-supplier=Digi-Key; Supplier Part Number 1: 1278380P; ComponentLink3Description: Where buy it; ComponentLink3URL: https://es.rs-online.com/web/p/circuitos-integrados-optoacopladores/1257571
U2 = Array_4_Amp_LM339D: Comparator Quad ±18V/36V 14-Pin SOIC Tube; Manufacturer: Texas Instruments; Number of Channels: 4; Nominal Supply Current: 2mA; Output Current: 20mA; Quiescent Current: 2.5mA; Max Supply Voltage: 30V; Min Supply Voltage: 2V; Min Dual Supply Voltage: 1V; Max Dual Supply Voltage: 15V; Voltage Gain: 106.02dB; Max Supply Current: 500uA; Input Bias Current: 250nA; Output Current per Channel: 6mA; Input Offset Voltage (Vos): 5mV; Response Time: 0.3us; Output Type: TTL; Dual Supply Voltage: 9V; .Creator: DO; Supplier 1: Digi-Key; RoHS: Yes; Category: Amplifiers - Op Amps, Buffer, Instrumentation; Stock 1: 10834; Pricing 1: 1=0,93000, 10=0,83500, 25=0,79240, 100=0,65090, 250=0,60848, 500=0,53774, 1000=0,46725 (USD); Mount: Surface Mount; Case/Package: SOIC; Number of Pins: 14; Contact Plating: Gold; Weight: 0.004318oz; Min Operating Temperature: 0°C; Max Operating Temperature: 70°C; Packaging: Rail/Tube; Package Quantity: 50; Number of Elements: 4; Supply Current: 2mA; Technology: BIPOLAR; Max Input Current: 250nA; Series: LM339; Length: 8.65mm; Width: 3.91mm; Height: 1.58mm; Radiation Hardening: No; REACH SVHC: No SVHC; Lead Free: Lead Free; RoHS Compliant: Yes; ComponentLink1URL: https://datasheet.ciiva.com/15131/getdatasheetpartid-248452-15131099.pdf?src-supplier=Verical; ComponentLink1Description: https://datasheet.ciiva.com/15131/getdatasheetpartid-248452-15131099.pdf?src-supplier=Verical; ComponentLink2URL: https://datasheet.ciiva.com/1483/1831045-1483000.pdf?src-supplier=Element14; ComponentLink2Description: https://datasheet.ciiva.com/1483/1831045-1483000.pdf?src-supplier=Element14; ComponentLink3URL: https://datasheet.ciiva.com/1827/lm139a-1827534.pdf?src-supplier=Digi-Key; ComponentLink3Description: https://datasheet.ciiva.com/1827/lm139a-1827534.pdf?src-supplier=Digi-Key; ComponentLink4URL: https://datasheet.ciiva.com/2970/lm2901-2970484.pdf?src-supplier=Avnet; ComponentLink4Description: https://datasheet.ciiva.com/2970/lm2901-2970484.pdf?src-supplier=Avnet; ComponentLink5URL: https://datasheet.ciiva.com/48712/001010753-da-01-en-ic-quad-diff-comp-lm339d-soic-14-tid-48712470.pdf?src-supplier=Conrad; ComponentLink5Description: https://datasheet.ciiva.com/48712/001010753-da-01-en-ic-quad-diff-comp-lm339d-soic-14-tid-48712470.pdf?src-supplier=Conrad; Supplier Part Number 1: 296-1013-5-ND; ComponentLink6Description: Where buy it; ComponentLink6URL: https://es.rs-online.com/web/p/comparadores/0858411; Manufacturer Part Number: LM339D
X_discharge = Relay_DBR72410FU: Relay, Reed Switch, SPNC, Rhodium Cntcts, 24VDC, 10kV Isol., PCB Mnt/Coil Conn./FL HV; Manufacturer: Cynergy3; Number of Poles: 1; Current Rating: 3A; Voltage Rating (DC): 24V; Coil Current: 25.9mA; Throw Configuration: SPST; Operate Time: 2ms; Release Time: 3ms; Coil Resistance: 925R; Contact Resistance: 50mR; Coil Type: Non-Latching; Life (Hours): 100000Hour; Supplier 1: Newark; Manufacturer Part Number: DBR72410F; RoHS: Yes; Category: Power Relays; Mount: Through Hole,PCB; Number of Pins: 4; Contact Material: Rhodium; Min Operating Temperature: -20°C; Max Operating Temperature: 70°C; Packaging: Tray; Package Quantity: 20; Termination: Wire Leads; Relay Type: Reed; Coil Voltage (DC): 24V; Contact Current Rating: 3A; Series: D; Length: 60mm; Height: 18.5mm; Depth: 15.8mm; RoHS Compliant: Yes; ComponentLink1URL: https://datasheet.ciiva.com/15041/dseries-15041454.pdf?src-supplier=Digi-Key; ComponentLink1Description: https://datasheet.ciiva.com/15041/dseries-15041454.pdf?src-supplier=Digi-Key; Supplier Part Number 1: 89C4343